# EAGLE design MySens-easyESP32b-009 (EAGLE 7.6.0)
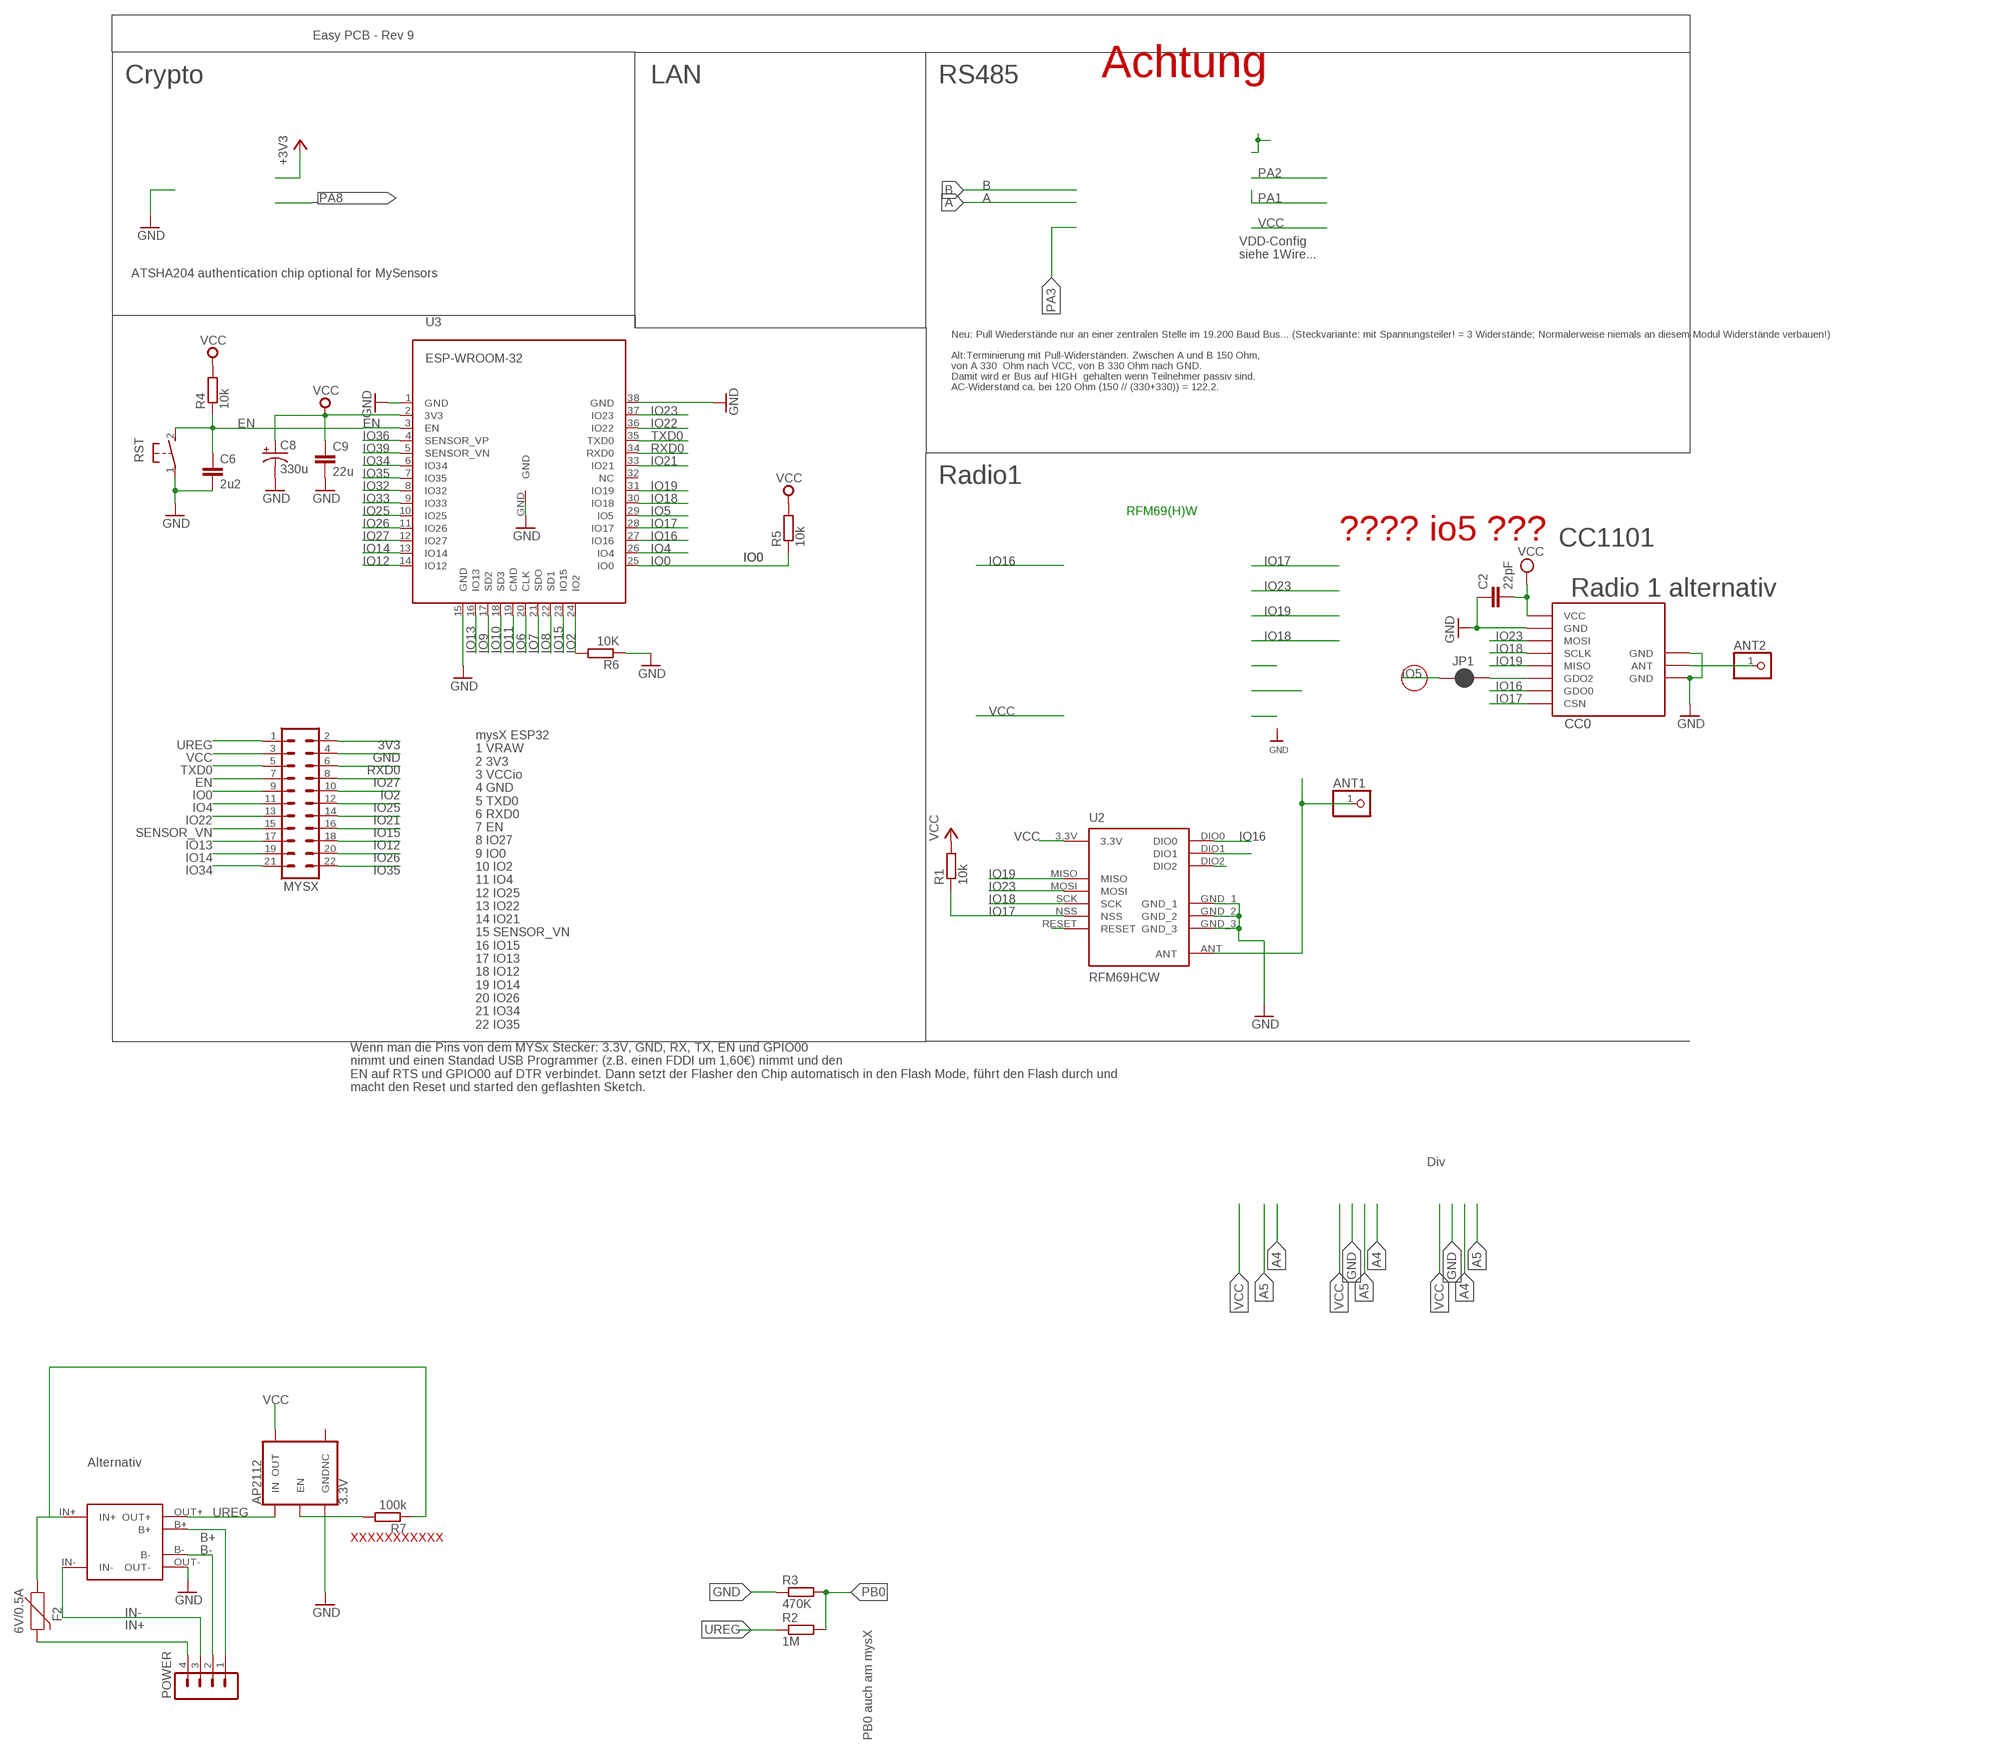
[diagram p0: schematic, sheet 1]

## Parts
ANT1  PINHD-1X1  [1X01]
ANT2  PINHD-1X1  [1X01]
AP2112  3.3V  V_REG_AP2112K-3.3V  [SOT23-5]
C2  22pF  C-EUC0805  [C0805]
C6  2u2  C-EUC0805  [C0805]
C8  330u  CAP_POLSMD  [VISHAY_C]
C9  22u  C-EUC0805  [C0805]
CC0  CC1101  CC1101_MODULE1SMD  [CC1101_MODULE1_SMD]
F2  6V/0.5A  PPTC_HALF-AMP  [1206]
JP1  JUMPER-SMT_2_NC_PASTE_NO-SILK  [SMT-JUMPER_2_NC_PASTE_NO-SILK]
MYSX  MA11-2  [MA11-2]
POWER  MA04-1  [MA04-1]
R1  10k  R-EU_M0805  [M0805]
R2  1M  R-EU_M0805  [M0805]
R3  470K  R-EU_M0805  [M0805]
R4  10k  R-EU_M0805  [M0805]
R5  10k  R-EU_R0603  [R0603]
R6  10K  R-EU_M0805  [M0805]
R7  100k  R-EU_M0805  [M0805]
RST  DTSM-3  [DTSM-3]
TP4056  TP4056-MODULE  [TP4056-LITHIUM-PROTECTED-MODULE]
U2  RFM69HCW  [RFM69HCW-XXXS2]
U3  ESP-WROOM-32  [ESP-WROOM-32]

## Nets
3V3: MYSX.2 ; supply symbol labelled +3V3
ANT0: ANT2.1 CC0.ANT
ANT1: ANT1.1 U2.ANT
B+ [vcc]: POWER.1 TP4056.B+
B- [gnd]: POWER.2 TP4056.B-
EN: C6.1 MYSX.7 R4.1 RST.2 U3.3(EN)
GND [gnd]: AP2112.2(GND) C2.1 C6.2 C8.- C9.2 CC0.GND@0(GND) CC0.GND@1(GND) CC0.GND@2(GND) MYSX.4 R3.1 R6.1 RST.1 TP4056.OUT- U2.GND_1 U2.GND_2 U2.GND_3 U3.1(GND) U3.15(GND) U3.38(GND) U3.GND
IN+ [vcc]: F2.2 POWER.4
IN++ [vcc]: F2.1 R7.1 TP4056.IN+
IN- [gnd]: POWER.3 TP4056.IN-
IO0: MYSX.9 R5.1 U3.25(IO0)
IO2: MYSX.10 R6.2 U3.24(IO2)
IO4: MYSX.11 U3.26(IO4)
IO5: JP1.1 U3.29(IO5)
IO6: U3.20(CLK)
IO7: U3.21(SDO)
IO8: U3.22(SD1)
IO9: U3.17(SD2)
IO10: U3.18(SD3)
IO11: U3.19(CMD)
IO12: MYSX.18 U3.14(IO12)
IO13: MYSX.17 U3.16(IO13)
IO14: MYSX.19 U3.13(IO14)
IO15: MYSX.16 U3.23(IO15)
IO16: CC0.GDO0 U2.DIO0 U3.27(IO16)
IO17: CC0.CSN R1.1 U2.NSS U3.28(IO17)
IO18: CC0.SCLK U2.SCK U3.30(IO18)
IO19: CC0.MISO U2.MISO U3.31(IO19)
IO21: MYSX.14 U3.33(IO21)
IO22: MYSX.13 U3.36(IO22)
IO23: CC0.MOSI U2.MOSI U3.37(IO23)
IO25: MYSX.12 U3.10(IO25)
IO26: MYSX.20 U3.11(IO26)
IO27: MYSX.8 U3.12(IO27)
IO32: U3.8(IO32)
IO33: U3.9(IO33)
IO34: MYSX.21 U3.6(IO34)
IO35: MYSX.22 U3.7(IO35)
IO36: U3.4(SENSOR_VP)
IO39: U3.5(SENSOR_VN)
MAYBE_IO5: CC0.GDO2 JP1.2
N$4: U2.DIO2
N$8: U2.DIO1
N$9: U2.RESET
N$12: AP2112.3(EN) R7.2
PB0: R2.2 R3.2
RXD0: MYSX.6 U3.34(RXD0)
SENSOR_VN: MYSX.15
TXD0: MYSX.5 U3.35(TXD0)
UREG [gnd]: AP2112.1(IN) MYSX.1 R2.1 TP4056.OUT+
VCC [gnd]: AP2112.5(OUT) C2.2 C8.+ C9.1 CC0.VCC MYSX.3 R1.2 R4.2 R5.2 U2.3.3V U3.2(3V3)
Unconnected: AP2112.4(NC) U3.32(NC)

## Notes on the sheet
- Easy PCB - Rev 9
- Crypto | LAN | RS485 | Achtung
- VDD-Config
  siehe 1Wire...
- ATSHA204 authentication chip optional for MySensors
- Neu: Pull Wiederstände nur an einer zentralen Stelle im 19.200 Baud Bus... (Steckvariante: mit Spannungsteiler! = 3 Widerstände; Normalerweise niemals an diesem Modul Widerstände verbauen!)
  
  Alt:Terminierung mit Pull-Widerständen. Zwischen A und B 150 Ohm,
  von A 330  Ohm nach VCC, von B 330 Ohm nach GND. 
  Damit wird er Bus auf HIGH  gehalten wenn Teilnehmer passiv sind.
  AC-Widerstand ca. bei 120 Ohm (150 // (330+330)) = 122,2.
- Radio1
- RFM69(H)W
- ???? io5 ??? | CC1101
- Radio 1 alternativ
- mysX ESP32
  1 VRAW
  2 3V3
  3 VCCio
  4 GND
  5 TXD0
  6 RXD0
  7 EN
  8 IO27
  9 IO0
  10 IO2
  11 IO4
  12 IO25
  13 IO22
  14 IO21
  15 SENSOR_VN
  16 IO15
  17 IO13
  18 IO12
  19 IO14
  20 IO26
  21 IO34
  22 IO35
- Wenn man die Pins von dem MYSx Stecker: 3.3V, GND, RX, TX, EN und GPIO00
  nimmt und einen Standad USB Programmer (z.B. einen FDDI um 1,60€) nimmt und den
  EN auf RTS und GPIO00 auf DTR verbindet. Dann setzt der Flasher den Chip automatisch in den Flash Mode, führt den Flash durch und
  macht den Reset und started den geflashten Sketch.
- Div
- Alternativ
- XXXXXXXXXXX
- PB0 auch am mysX

## Library data of the parts
ANT1 ANT2 = pinhead:PINHD-1X1: PIN HEADER
AP2112 = SparkFun-IC-Power:V_REG_AP2112: AP2112 - 600mA CMOS LDO Regulator w/ Enable The AP2112 is CMOS process low dropout linear regulator with enable function, the regulator delivers a guaranteed 600mA (min.) continuous load current. Features Output Voltage Accuracy: ±1.5% Output Current: 600mA (Min.) Foldback Short Current Protection: 50mA Enable Function to Turn ON/OFF VOUT Low Dropout Voltage (3.3V): 250mV (Typ.) @IOUT=600mA Excellent Load Regulation: 0.2%/A (Typ.) Excellent Line Regulation: 0.02%/V (Typ.) Low Quiescent Current: 55μA (Typ.) Low Standby Current: 0.01μA (Typ.) Low Output Noise: 50μVRMS PSRR: 100Hz -65dB, 1kHz -65dB OTSD Protection Stable with 1.0μF Flexible Cap: Ceramic, Tantalum and Aluminum Electrolytic Operation Temperature Range: -40°C to 85°C ESD: MM 400V, HBM 4000V; PROD_ID: VREG-12457
C2 = rcl:C-EU: CAPACITOR, European symbol
C6 C9 = rcl@1:C-EU: CAPACITOR, European symbol; SPICEPREFIX: C
C8 = SparkFun-Passives:CAP_POL: Capacitor Polarized These are standard SMD and PTH capacitors. Normally 10uF, 47uF, and 100uF in electrolytic and tantalum varieties. Always verify the external diameter of the through hole cap, it varies with capacity, voltage, and manufacturer. The EIA devices should be standard.
CC0 = wireless:CC1101_MODULE1: CC1101 wireless module for 433/868 MHz (sold from Aliexpress). DIL version for mounting with pin header (and SMD soldering) and SMD only variant available.
F2 = SparkFun-Fuses:PPTC: Resettable Fuse PPTC Resettable Fuse. Really a sort of resistor with a polymeric positive temperature coefficient whose resistance increases dramatically with an increase in temperature. When heated by the power passing through the resistance rises causing the current to be limited, protecting the circuit. This is achieved by the transition of the polymer from a crystalline to an amorphous state where the conductive carbon separates breaking the conductive pathways found in the cool crystalline structure. When a PPTC cools back down it resumes conducting letting the circuit turn back on. SparkFun Products: SparkFun RedBoard - Programmed with Arduino <https://www.sparkfun.com/products/12757> Pro Micro - 5V/16MHz <https://www.sparkfun.com/products/12640> Arduino Pro 328 - 5V/16MHz <https://www.sparkfun.com/products/10915> MP3 Trigger <https://www.sparkfun.com/products/13720>; PROD_ID: RES-08585
JP1 = SparkFun-Jumpers:JUMPER-SMT_2_NC_PASTE: Normally closed solder jumper This jumper has an aperture in the stencil to allow solder paste to bridge the split in the wire so it's normally closed (NC). Wick off the solder to open the connection. Reapply solder to reclose the connection.
MYSX = con-Pinheader:MA11-2: PIN HEADER; OC_FARNELL: unknown; OC_NEWARK: unknown
POWER = con-lstb:MA04-1: PIN HEADER; OC_FARNELL: unknown; OC_NEWARK: unknown
R1-R3 R5-R7 = rcl:R-EU_: RESISTOR, European symbol
R4 = rcl@1:R-EU_: RESISTOR, European symbol; SPICEPREFIX: R
RST = switch-tact:DTSM-3
TP4056 = tp2112-usw-V2:TP4056-MODULE
U2 = doug:RFM69H
U3 = esp32:ESP-WROOM-32

## Net classes
0 default: width 0.305 mm, clearance 0.205 mm
1 gnd: width 0.457 mm, drill 0.635 mm, clearance 0.254 mm
2 vcc: width 0.406 mm, drill 0.406 mm, clearance 0.254 mm

## Board
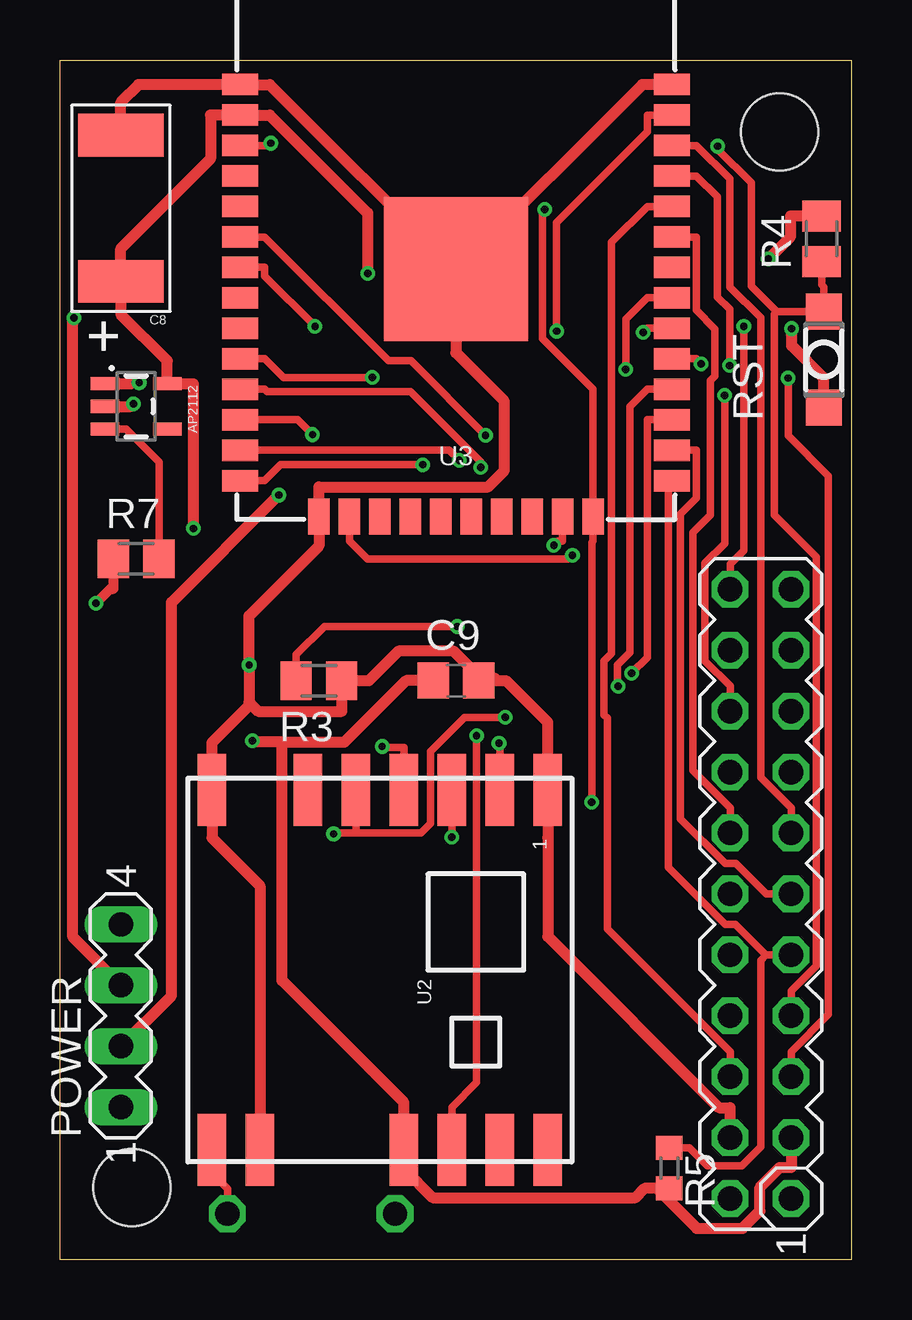
[diagram p1: board, top side]
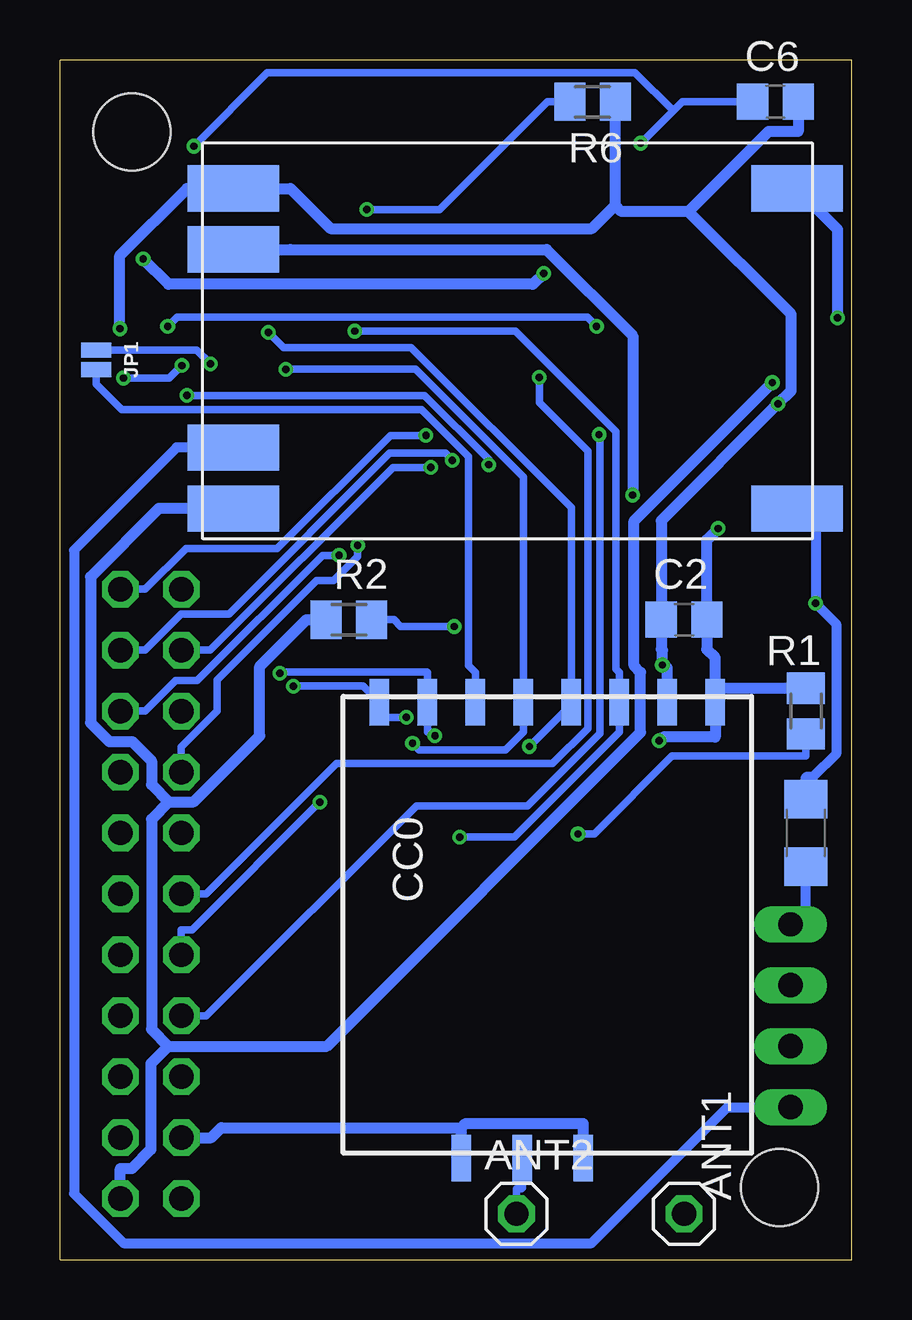
[diagram p2: board, bottom side, seen from below]

Size 33 x 50 mm. Coordinates in mm from the lower left corner, seen from the top.
Outline: 0,0 0,50 33,50 33,0 0,0
Copper layers (1*16): Top 0.035mm / dielectric 1.5mm / Bottom 0.035mm
Design rules "dirt_cheap_dirty_boards.v1": minimum track width 5mil, minimum drill 12mil, track to track 5mil, track to pad 5mil, pad to pad 5mil, via to via 5mil, smd to smd 0mil, copper to edge 10mil, drill to drill 10mil, minimum pad ring 10mil, minimum via ring 6mil, stop-mask expansion 2mil, vias tented up to drill 25mil, thermal gap 10mil
Holes 3.2 mm at 3,3 30,47

### Footprints (pad centres in the part's own frame; a part is rotated, then mirrored left to right if it is on the bottom)
1X01 = drill 1.016 octagon: 1 0,0
SOT23-5 = smd 0.55 x 1.2: 1 -0.95,-1.3; 2 0,-1.3; 3 0.95,-1.3; 4 0.95,1.3; 5 -0.95,1.3
C0805 = smd 1.3 x 1.5: 1 -0.95,0; 2 0.95,0
VISHAY_C = smd 3.556 x 1.778: + 0,3.048; - 0,-3.048
CC1101_MODULE1_SMD = smd 1.93 x 0.813: ANT 19,5.96; CSN 0,0; GDO0 0,2; GDO2 0,4; GND@0 0,12; GND@1 19,8.5; GND@2 19,3.42; MISO 0,6; MOSI 0,10; SCLK 0,8; VCC 0,14
1206 = smd 1.6 x 1.8: 1 -1.4,0; 2 1.4,0
SMT-JUMPER_2_NC_PASTE_NO-SILK = smd 0.635 x 1.27: 1 -0.406,0; 2 0.406,0
MA11-2 = drill 1.016 octagon: 1 -12.7,-1.27; 2 -12.7,1.27; 3 -10.16,-1.27; 4 -10.16,1.27; 5 -7.62,-1.27; 6 -7.62,1.27; 7 -5.08,-1.27; 8 -5.08,1.27; 9 -2.54,-1.27; 10 -2.54,1.27; 11 0,-1.27; 12 0,1.27; 13 2.54,-1.27; 14 2.54,1.27; 15 5.08,-1.27; 16 5.08,1.27; 17 7.62,-1.27; 18 7.62,1.27; 19 10.16,-1.27; 20 10.16,1.27; 21 12.7,-1.27; 22 12.7,1.27
MA04-1 = drill 1.016 long: 1 -3.81,0; 2 -1.27,0; 3 1.27,0; 4 3.81,0
M0805 = smd 1.3 x 1.6: 1 -0.95,0; 2 0.95,0
R0603 = smd 1 x 1.1: 1 -0.85,0; 2 0.85,0
DTSM-3 = smd 1.5 x 1.5: 1 -2,0; 2 2,0
TP4056-LITHIUM-PROTECTED-MODULE = smd 3.81 x 1.93: B+ 11.43,4.445; B- 11.43,-3.81; IN+ -12.065,6.985; IN- -12.065,-6.35; OUT+ 11.43,6.985; OUT- 11.43,-6.35
RFM69HCW-XXXS2 = smd 3 x 1.2: 3.3V 7.5,1; ANT 7.5,-7; DIO0 7.5,3; DIO1 7.5,5; DIO2 7.5,7; GND_1 7.5,-5; GND_2 -7.5,-7; GND_3 -7.5,7; MISO -7.5,5; MOSI -7.5,3; NSS -7.5,-1; RESET -7.5,-3; SCK -7.5,1
ESP-WROOM-32 = smd 0.9 x 1.5: 1 7.7,9; 2 6.43,9; 3 5.16,9; 4 3.89,9; 5 2.62,9; 6 1.35,9; 7 0.08,9; 8 -1.19,9; 9 -2.46,9; 10 -3.73,9; 11 -5,9; 12 -6.27,9; 13 -7.54,9; 14 -8.81,9; 25 -8.81,-9; 26 -7.54,-9; 27 -6.27,-9; 28 -5,-9; 29 -3.73,-9; 30 -2.46,-9; 31 -1.19,-9; 32 0.08,-9; 33 1.35,-9; 34 2.62,-9; 35 3.89,-9; 36 5.16,-9; 37 6.43,-9; 38 7.7,-9 | smd 1.5 x 0.9: 15 -10.3,5.715; 16 -10.3,4.445; 17 -10.3,3.175; 18 -10.3,1.905; 19 -10.3,0.635; 20 -10.3,-0.635; 21 -10.3,-1.905; 22 -10.3,-3.175; 23 -10.3,-4.445; 24 -10.3,-5.715 | smd 6 x 6: GND 0,0

### Placement (x,y rotation side)
ANT1  6.99,1.91 0 bottom
ANT2  13.97,1.91 0 bottom
AP2112  3.17,35.56 270 top
C2  6.99,26.67 0 bottom
C6  3.17,48.26 0 bottom
C8  2.54,43.81 180 top
C9  16.51,24.13 0 top
CC0  19.68,23.23 270 bottom
F2  1.91,17.78 270 bottom
JP1  31.49,37.5 270 bottom
MYSX  29.21,15.24 90 top
POWER  2.54,10.16 90 top
R1  1.91,22.86 90 bottom
R2  20.95,26.67 0 bottom
R3  10.79,24.13 180 top
R4  31.75,42.55 90 top
R5  25.4,3.81 270 top
R6  10.79,48.26 180 bottom
R7  3.17,29.21 0 top
RST  31.84,37.51 90 top
TP4056  14.35,38.29 180 bottom
U2  13.34,12.06 270 top
U3  16.51,41.27 90 top

### Tracks (layer width: path | path; a pad name or v marks a point on that pad's centre or on a via)
ANT0
  Bottom 0.305: ANT2.1 13.97,2.95 13.76,2.95 13.72,2.98 CC0.ANT
ANT1
  Top 0.305: ANT1.1 6.99,2.95 6.33,3.6 U2.ANT
B+
  Bottom 0.406: TP4056.B+ 28.14,33.84 32.41,29.57 32.41,2.74 30.35,0.68 10.84,0.68 5.17,6.35 POWER.1
B-  (via drill 0.3 pad 0.61)
  Top 0.457: POWER.2 4.65,11 4.65,27.39 v9.12,31.87
  Bottom 0.457: v9.12,31.87 9.12,38.51 12.71,42.1 23.39,42.1 TP4056.B-
EN  (via drill 0.3 pad 0.61)
  Top 0.305: 29.88,39.51 28.82,40.57 28.82,44.88 27.41,46.28 v27.41,46.41 | 29.88,39.51 29.77,39.41 29.77,31.04 31.52,29.28 31.52,12.25 30.48,11.2 MYSX.7 | 29.88,39.51 30.81,39.51 30.82,39.51 RST.2 31.84,40.54 31.75,40.63 R4.1 | v8.79,46.53 8.7,46.44 8.54,46.44 U3.3
  Bottom 0.305: 7.44,47.88 v8.79,46.53 | 7.44,47.88 7.06,48.26 5.05,48.26 C6.1 | 7.44,47.88 9.02,49.47 24.36,49.47 v27.41,46.41
GND  (via drill 0.3 pad 0.61)
  Top 0.457: U3.GND 16.44,41.27 8.74,48.98 U3.1 3.28,48.98 2.54,48.23 C8.- | U3.GND 16.51,40.95 16.51,37.79 18.53,35.77 18.53,32.89 17.85,32.21 10.79,32.21 U3.15 10.79,29.74 7.88,26.83 v7.88,24.78 7.88,23.23 7.95,23.16 | U3.GND 16.58,41.27 24.28,48.98 U3.38 | v3.06,35.67 2.96,35.56 AP2112.2 | v30.5,38.8 30.5,38.08 31.84,36.74 RST.1 | 17.55,24.22 C9.2 | 17.55,24.22 18.12,24.22 18.21,24.13 18.59,24.13 20.34,22.39 20.34,21.55 U2.GND_3 20.34,17.58 20.34,13.46 27.47,6.33 27.94,6.33 MYSX.4 | 17.55,24.22 16.42,25.36 14.11,25.36 12.88,24.13 R3.1 11.74,22.85 8.27,22.85 7.95,23.16 | 7.95,23.16 6.33,21.55 U2.GND_2 6.33,17.58 8.34,15.58 U2.GND_1
  Bottom 0.457: 6.79,43.68 3.45,47.03 2.23,47.03 C6.2 | 6.79,43.68 2.51,39.41 2.51,36.22 v3.06,35.67 7.93,30.8 C2.1 7.93,25.44 7.88,25.39 v7.88,24.78 7.79,24.78 7.68,24.67 CC0.GND@0 | 6.79,43.68 9.59,43.68 9.85,43.94 | 9.85,43.94 R6.1 | 9.85,43.94 10.81,42.97 21.72,42.97 23.39,44.64 TP4056.OUT- 27.34,44.64 27.71,44.64 30.5,41.84 v30.5,38.8 | 16.27,5.5 26.28,5.5 26.7,5.08 MYSX.4 | CC0.GND@1 11.19,5.67 16.09,5.67 16.27,5.5 | CC0.GND@2 16.27,5.5
IN+
  Bottom 0.406: POWER.4 1.91,14.61 F2.2
IN++  (via drill 0.3 pad 0.61)
  Top 0.406: R7.1 2.23,27.95 2.1,27.95 v1.5,27.35
  Bottom 0.406: TP4056.IN+ 1.5,30.52 v1.5,27.35 0.64,26.5 0.64,21.07 1.61,20.11 1.91,20.11 F2.1
IN-  (via drill 0.3 pad 0.61)
  Top 0.457: POWER.3 0.53,13.44 0.53,39.2 v0.58,39.25
  Bottom 0.457: TP4056.IN- 0.58,42.95 v0.58,39.25
IO0
  Top 0.305: 29.43,12.69 29.44,12.7 29.5,12.7 MYSX.9 | 29.43,12.69 29.21,12.47 29.21,4.7 28.42,3.91 26.98,3.91 26.23,4.66 R5.1 | U3.25 25.36,32.31 25.36,16.34 27.73,13.97 28.16,13.97 29.43,12.69
IO2  (via drill 0.3 pad 0.61)
  Top 0.305: v20.2,43.77 20.12,43.68 20.12,38.38 22.23,36.27 U3.24 22.23,30.46 22.23,29.95 22.17,29.89 v22.17,19.07
  Bottom 0.305: v20.2,43.77 17.17,43.77 12.67,48.26 R6.2 | v22.17,19.07 27.5,13.74 27.94,13.74 MYSX.10
IO4
  Top 0.305: MYSX.11 29.44,15.24 28.17,16.51 27.74,16.51 25.87,18.37 25.87,31.07 26.54,31.74 26.54,33.73 U3.26
IO5  (via drill 0.3 pad 0.61)
  Top 0.305: U3.29 26.54,37.55 26.54,37.52 v26.73,37.33
  Bottom 0.305: JP1.1 30.58,37.91 27.3,37.91 v26.73,37.33
IO12  (via drill 0.3 pad 0.61)
  Top 0.305: v15.12,33.13 9.21,33.13 8.54,32.47 U3.14 | v27.71,36.01 27.71,29.84 26.89,29.02 26.89,24.95 27.94,23.9 MYSX.18
  Bottom 0.305: v27.71,36.01 17.8,36.01 15.12,33.34 v15.12,33.13
IO13  (via drill 0.3 pad 0.61)
  Top 0.305: v21.36,29.35 21.2,29.19 12.82,29.19 12.06,29.95 U3.16
  Bottom 0.305: v21.36,29.35 22.06,29.35 27.28,24.13 28.17,24.13 29.44,22.86 MYSX.17
IO14  (via drill 0.3 pad 0.61)
  Top 0.305: U3.13 8.54,33.73 16.23,33.73 v16.65,33.32
  Bottom 0.305: MYSX.19 29.44,25.4 27.94,26.9 25.96,26.9 19.25,33.6 16.93,33.6 v16.65,33.32
IO15  (via drill 0.3 pad 0.61)
  Top 0.305: v20.59,29.78 20.76,29.95 20.95,29.95 U3.23
  Bottom 0.305: v20.59,29.78 20.59,29.3 21.59,28.3 22.3,28.3 26.44,24.16 26.44,22.86 27.94,21.36 MYSX.16
IO16  (via drill 0.3 pad 0.61)
  Top 0.305: U3.27 24.48,35.01 24.48,25.09 v23.83,24.44 | U2.DIO0 16.34,6.34 17.37,7.38 v17.37,21.83
  Bottom 0.305: v23.83,24.44 23.79,24.48 17.7,24.48 17.68,24.47 CC0.GDO0 17.68,21.98 17.52,21.98 v17.37,21.83
IO17  (via drill 0.3 pad 0.61)
  Top 0.305: U3.28 24.48,36.27 23.75,35.55 23.75,25.3 23.25,24.79 23.25,23.93 v23.28,23.9 | v18.56,22.6 16.87,22.6 15.46,21.19 15.46,18.18 15.06,17.79 12.34,17.79 | 12.34,17.79 | 12.34,17.79 11.45,17.79 v11.41,17.74 | U2.NSS 12.34,17.79
  Bottom 0.305: v23.28,23.9 20.36,23.9 CC0.CSN 19.68,22.6 v18.56,22.6 | v18.56,22.6 | v11.41,17.74 10.72,17.74 7.48,20.98 1.91,20.98 R1.1
IO18  (via drill 0.3 pad 0.61)
  Top 0.305: v13.43,21.39 13.47,21.34 14.34,21.34 U2.SCK | v24.31,38.65 24.48,38.81 U3.30
  Bottom 0.305: v24.31,38.65 23.69,38.02 18.36,38.02 11.69,31.34 11.69,24.47 CC0.SCLK 11.69,23.13 v13.43,21.39
IO19  (via drill 0.3 pad 0.61)
  Top 0.305: v23.59,37.11 23.59,39.19 24.48,40.09 U3.31 | v18.3,21.52 18.3,21.38 18.34,21.34 U2.MISO
  Bottom 0.305: v23.59,37.11 18.17,37.11 13.69,32.62 13.69,24.47 CC0.MISO 13.69,21.98 14.42,21.24 18.02,21.24 v18.3,21.52
IO21
  Top 0.305: MYSX.14 27.94,18.82 26.38,20.38 26.38,30.3 27.12,31.04 27.12,36.64 27.31,36.83 27.31,38.79 26.54,39.56 26.54,42.62 U3.33
IO22
  Top 0.305: MYSX.13 30.48,18.82 29.21,20.09 29.21,39.25 27.92,40.54 27.92,45.05 26.54,46.44 U3.36
IO23  (via drill 0.3 pad 0.61)
  Top 0.305: U3.37 24.48,47.7 24.48,47 20.71,43.23 v20.71,38.7 | v16.34,17.61 U2.MOSI
  Bottom 0.305: v20.71,38.7 14.01,38.7 9.83,34.52 9.83,24.62 9.69,24.47 CC0.MOSI 9.69,22.6 9.69,21.98 14.06,17.61 v16.34,17.61
IO25  (via drill 0.3 pad 0.61)
  Top 0.305: v13.02,36.77 9.32,36.77 8.54,37.55 U3.10
  Bottom 0.305: v13.02,36.77 13.02,35.72 11,33.7 11,22.14 12.47,20.67 21.47,20.67 26.9,15.24 MYSX.12
IO26  (via drill 0.3 pad 0.61)
  Top 0.305: v17.55,33.02 17.55,33.24 14.61,36.18 8.63,36.18 8.54,36.27 U3.11
  Bottom 0.305: v17.55,33.02 19.12,33.02 26.73,25.4 MYSX.20
IO27  (via drill 0.3 pad 0.61)
  Top 0.305: U3.12 9.91,35.01 v10.53,34.39
  Bottom 0.305: MYSX.8 26.9,10.16 18.14,18.92 13.5,18.92 10.48,21.93 10.48,34.34 v10.53,34.39
IO34  (via drill 0.3 pad 0.61)
  Top 0.305: U3.6 8.54,42.62 13.7,37.46 14.63,37.46 v17.74,34.35
  Bottom 0.305: MYSX.21 29.44,27.94 27.74,29.64 23.94,29.64 19.23,34.35 v17.74,34.35
IO35  (via drill 0.3 pad 0.61)
  Top 0.305: v28.51,38.9 28.51,29.55 27.94,28.98 MYSX.22 | U3.7 8.54,41.35 8.54,40.99 v10.63,38.9
  Bottom 0.305: v10.63,38.9 11.02,39.29 28.12,39.29 v28.51,38.9
MAYBE_IO5
  Bottom 0.305: CC0.GDO2 15.69,24.47 15.97,24.76 15.97,33.47 17.93,35.43 30.42,35.43 31.49,36.5 JP1.2
N$12
  Top 0.305: AP2112.3 2.75,34.61 4.12,33.24 R7.2
PB0  (via drill 0.3 pad 0.61)
  Top 0.305: v16.57,26.39 11.02,26.39 9.85,25.21 R3.2
  Bottom 0.305: v16.57,26.39 18.79,26.39 19.08,26.67 R2.2
RXD0
  Top 0.305: MYSX.6 27.94,8.66 22.81,13.79 22.81,22.57 22.69,22.7 22.69,24.95 22.99,25.25 22.99,42.41 24.48,43.9 U3.34
TXD0  (via drill 0.3 pad 0.61)
  Top 0.305: v27.92,37.26 27.92,39.61 27.41,40.12 27.41,44.29 26.54,45.16 U3.35 | v30.36,36.74 30.36,34.34 32.04,32.66 32.04,10.22 30.48,8.66 MYSX.5
  Bottom 0.305: v30.36,36.74 28.45,36.74 v27.92,37.26
UREG  (via drill 0.3 pad 0.61)
  Top 0.457: v3.3,36.55 3,36.55 2.96,36.51 AP2112.1
  Bottom 0.457: 28.48,8.89 21.87,8.89 8.79,21.97 8.79,24.48 9.07,24.75 9.07,30.79 v3.3,36.55 | 28.46,19.07 29.19,18.35 29.19,9.6 28.48,8.89 | 28.48,8.89 29.21,8.16 29.21,4.58 30.01,3.79 30.48,3.79 MYSX.1 | 28.46,19.07 27.43,19.07 24.67,21.83 24.67,24.72 22.72,26.67 R2.1 | TP4056.OUT+ 28.88,31.3 31.73,28.45 31.73,22.37 30.94,21.59 29.98,21.59 29.18,20.79 29.18,19.8 28.46,19.07
VCC  (via drill 0.3 pad 0.61)
  Top 0.457: 9.25,21.57 8.07,21.57 v8.02,21.62 | v29.53,41.7 30.47,42.64 30.47,43.49 R4.2 | 9.25,21.57 11.86,21.57 14.43,24.13 C9.1 | 9.25,21.57 9.25,11.63 14.34,6.55 U2.3.3V 14.34,3.78 15.53,2.58 23.99,2.58 24.37,2.96 24.88,2.96 | v12.83,41.1 12.83,43.62 8.74,47.7 7.95,47.7 U3.2 6.28,47.7 6.28,45.88 2.54,42.14 C8.+ 2.54,39.4 4.47,37.46 AP2112.5 5.56,36.51 v5.56,30.47 | MYSX.3 30.48,3.83 30.01,3.83 29.18,3.01 29.18,2.02 28.45,1.29 26.55,1.29 24.88,2.96 | R5.2 24.88,2.96
  Bottom 0.457: v8.02,21.62 7.86,21.78 5.68,21.78 CC0.VCC 5.68,23.81 | v12.83,41.1 13.28,40.65 28.48,40.65 v29.53,41.7 | v5.56,30.47 6.04,30 6.04,27.9 C2.2 6.04,25.44 5.68,25.09 5.68,23.81 | R1.2 5.68,23.81

### Text on the board
tNames: easyGW BluePill 0.2 / RS485, RFM69, RFM95 | VCC | GND | SDL | SDA | 5V | UREG | GND | 5V
bNames: PluepillGW V01 / RS485, RFM69, RFM95
Document: DS_1551K